# Altium schematic sheet Main.SchDoc: Lab. Proj. PCB
size A4; Author: Tomasz Machnik; Revision: 1; SheetNumber: 1; SheetTotal: 7
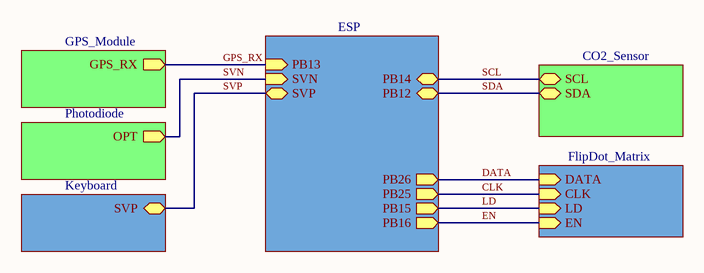
[diagram p0: Main.SchDoc]

## Sub-sheets
CO2_Sensor = CO2_Sensor.SchDoc: SCL (bidir), SDA (bidir)
ESP = ESP.SchDoc: PB12 (bidir), PB14 (bidir), PB13 (in), SVN (in), SVP (bidir), PB25 (out), PB26 (out), PB15 (out), PB16 (out)
FlipDot_Matrix = FlipDot_Matrix.SchDoc: EN (in), LD (in), CLK (in), DATA (in)
GPS_Module = GPS_Module.SchDoc: GPS_RX (out)
Keyboard = Keyboard.SchDoc: SVP (bidir)
Photodiode = Photodiode.SchDoc: OPT (out)

## Nets
CLK: sheet ESP/PB25, sheet FlipDot_Matrix/CLK
DATA: sheet ESP/PB26, sheet FlipDot_Matrix/DATA
EN: sheet ESP/PB16, sheet FlipDot_Matrix/EN
GPS_RX: sheet ESP/PB13, sheet GPS_Module/GPS_RX
LD: sheet ESP/PB15, sheet FlipDot_Matrix/LD
SCL: sheet ESP/PB14, sheet CO2_Sensor/SCL
SDA: sheet ESP/PB12, sheet CO2_Sensor/SDA
SVN: sheet ESP/SVN, sheet Photodiode/OPT
SVP: sheet ESP/SVP, sheet Keyboard/SVP

## Notes on the sheet
- Title:
- Author:
- Approved:
- Size:
- Date:
- Git Hash:
- A4
- Prj:
- SW Version:
- Variant:
- Edited:
- CONFIDENTIAL
- File: